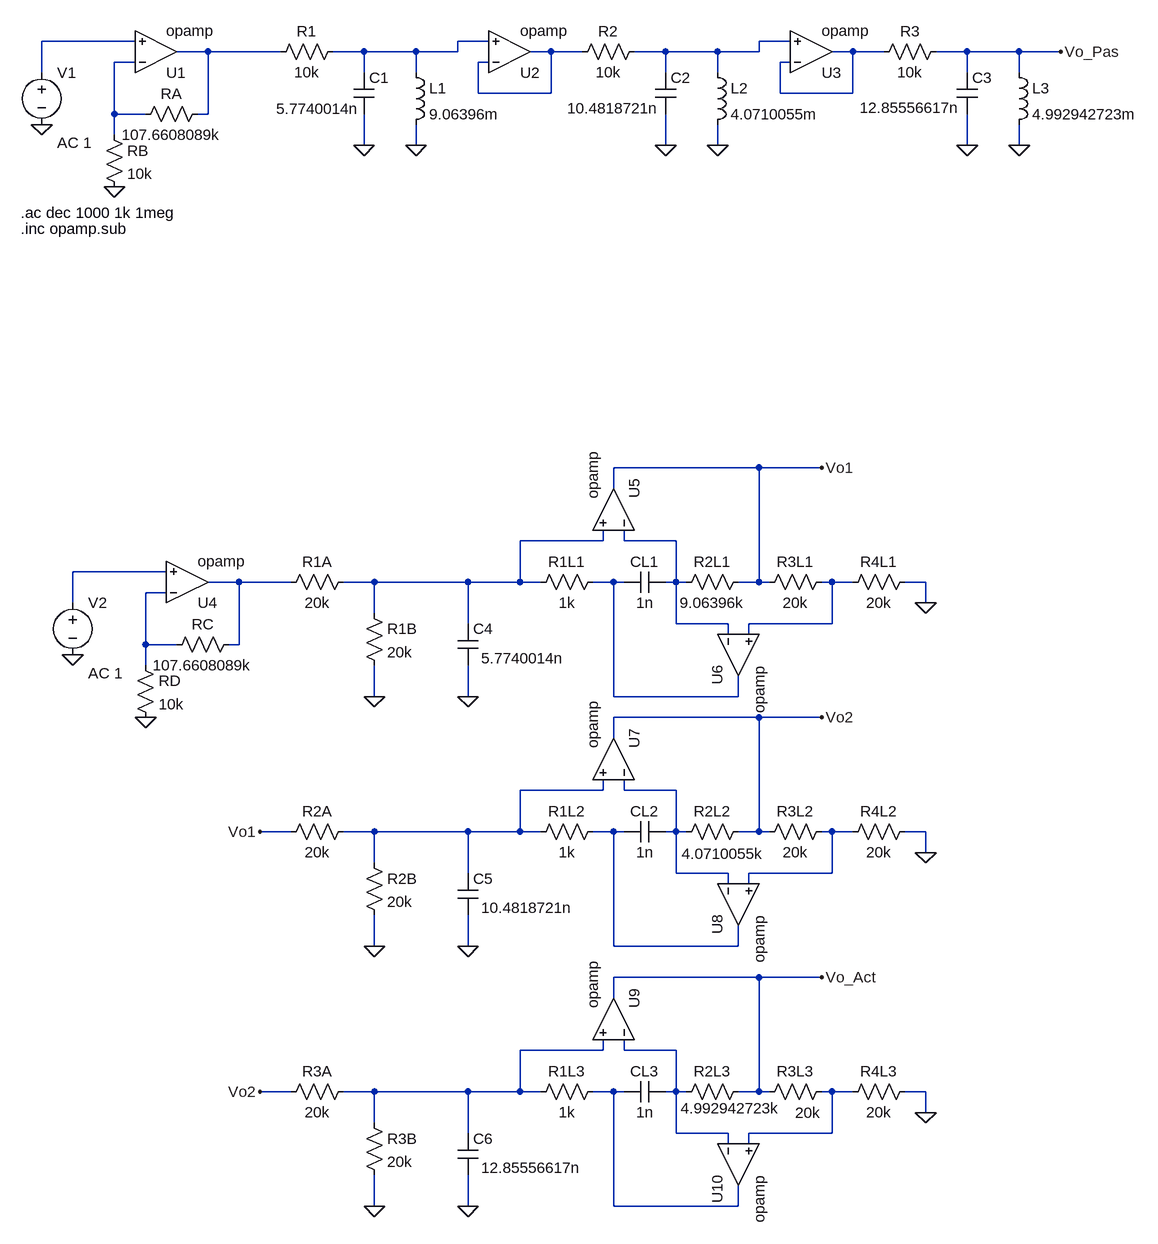
[diagram p0: schematic SeccionesPasivas.asc]
SeccionesPasivas.asc, the LTspice schematic file:
Version 4
SHEET 1 1620 1908
WIRE 0 96 -144 96
WIRE 544 96 496 96
WIRE 1008 96 960 96
WIRE 112 112 64 112
WIRE 224 112 112 112
WIRE 352 112 304 112
WIRE 432 112 352 112
WIRE 496 112 496 96
WIRE 496 112 432 112
WIRE 640 112 608 112
WIRE 688 112 640 112
WIRE 816 112 768 112
WIRE 896 112 816 112
WIRE 960 112 960 96
WIRE 960 112 896 112
WIRE 1104 112 1072 112
WIRE 1152 112 1104 112
WIRE 1280 112 1232 112
WIRE 1360 112 1280 112
WIRE 1424 112 1360 112
WIRE 0 128 -32 128
WIRE 544 128 528 128
WIRE 1008 128 992 128
WIRE -144 144 -144 96
WIRE 352 144 352 112
WIRE 432 144 432 112
WIRE 816 144 816 112
WIRE 896 144 896 112
WIRE 1280 144 1280 112
WIRE 1360 144 1360 112
WIRE 528 176 528 128
WIRE 640 176 640 112
WIRE 640 176 528 176
WIRE 992 176 992 128
WIRE 1104 176 1104 112
WIRE 1104 176 992 176
WIRE -32 208 -32 128
WIRE 16 208 -32 208
WIRE 112 208 112 112
WIRE 112 208 96 208
WIRE -32 240 -32 208
WIRE 352 256 352 208
WIRE 432 256 432 224
WIRE 816 256 816 208
WIRE 896 256 896 224
WIRE 1280 256 1280 208
WIRE 1360 256 1360 224
WIRE 960 752 736 752
WIRE 1056 752 960 752
WIRE 736 784 736 752
WIRE 720 864 720 848
WIRE 720 864 592 864
WIRE 752 864 752 848
WIRE 832 864 752 864
WIRE 48 912 -96 912
WIRE 160 928 112 928
WIRE 240 928 160 928
WIRE 368 928 320 928
WIRE 512 928 368 928
WIRE 592 928 592 864
WIRE 592 928 512 928
WIRE 624 928 592 928
WIRE 736 928 704 928
WIRE 752 928 736 928
WIRE 832 928 832 864
WIRE 832 928 816 928
WIRE 848 928 832 928
WIRE 960 928 960 752
WIRE 960 928 928 928
WIRE 976 928 960 928
WIRE 1072 928 1056 928
WIRE 1104 928 1072 928
WIRE 1216 928 1184 928
WIRE 48 944 16 944
WIRE -96 960 -96 912
WIRE 1216 960 1216 928
WIRE 368 976 368 928
WIRE 512 992 512 928
WIRE 832 992 832 928
WIRE 912 992 832 992
WIRE 1072 992 1072 928
WIRE 1072 992 944 992
WIRE 912 1008 912 992
WIRE 944 1008 944 992
WIRE 16 1024 16 944
WIRE 64 1024 16 1024
WIRE 160 1024 160 928
WIRE 160 1024 144 1024
WIRE 16 1056 16 1024
WIRE 368 1104 368 1056
WIRE 512 1104 512 1056
WIRE 736 1104 736 928
WIRE 928 1104 928 1072
WIRE 928 1104 736 1104
WIRE 960 1136 736 1136
WIRE 1056 1136 960 1136
WIRE 736 1168 736 1136
WIRE 720 1248 720 1232
WIRE 720 1248 592 1248
WIRE 752 1248 752 1232
WIRE 832 1248 752 1248
WIRE 240 1312 192 1312
WIRE 368 1312 320 1312
WIRE 512 1312 368 1312
WIRE 592 1312 592 1248
WIRE 592 1312 512 1312
WIRE 624 1312 592 1312
WIRE 736 1312 704 1312
WIRE 752 1312 736 1312
WIRE 832 1312 832 1248
WIRE 832 1312 816 1312
WIRE 848 1312 832 1312
WIRE 960 1312 960 1136
WIRE 960 1312 928 1312
WIRE 976 1312 960 1312
WIRE 1072 1312 1056 1312
WIRE 1104 1312 1072 1312
WIRE 1216 1312 1184 1312
WIRE 1216 1344 1216 1312
WIRE 368 1360 368 1312
WIRE 512 1376 512 1312
WIRE 832 1376 832 1312
WIRE 912 1376 832 1376
WIRE 1072 1376 1072 1312
WIRE 1072 1376 944 1376
WIRE 912 1392 912 1376
WIRE 944 1392 944 1376
WIRE 368 1488 368 1440
WIRE 512 1488 512 1440
WIRE 736 1488 736 1312
WIRE 928 1488 928 1456
WIRE 928 1488 736 1488
WIRE 960 1536 736 1536
WIRE 1056 1536 960 1536
WIRE 736 1568 736 1536
WIRE 720 1648 720 1632
WIRE 720 1648 592 1648
WIRE 752 1648 752 1632
WIRE 832 1648 752 1648
WIRE 240 1712 192 1712
WIRE 368 1712 320 1712
WIRE 512 1712 368 1712
WIRE 592 1712 592 1648
WIRE 592 1712 512 1712
WIRE 624 1712 592 1712
WIRE 736 1712 704 1712
WIRE 752 1712 736 1712
WIRE 832 1712 832 1648
WIRE 832 1712 816 1712
WIRE 848 1712 832 1712
WIRE 960 1712 960 1536
WIRE 960 1712 928 1712
WIRE 976 1712 960 1712
WIRE 1072 1712 1056 1712
WIRE 1104 1712 1072 1712
WIRE 1216 1712 1184 1712
WIRE 1216 1744 1216 1712
WIRE 368 1760 368 1712
WIRE 512 1776 512 1712
WIRE 832 1776 832 1712
WIRE 912 1776 832 1776
WIRE 1072 1776 1072 1712
WIRE 1072 1776 944 1776
WIRE 912 1792 912 1776
WIRE 944 1792 944 1776
WIRE 368 1888 368 1840
WIRE 512 1888 512 1840
WIRE 736 1888 736 1712
WIRE 928 1888 928 1856
WIRE 928 1888 736 1888
FLAG -32 320 0
FLAG 352 256 0
FLAG 432 256 0
FLAG 816 256 0
FLAG 896 256 0
FLAG 1280 256 0
FLAG 1360 256 0
FLAG 1424 112 Vo_Pas
FLAG -144 224 0
FLAG 16 1136 0
FLAG -96 1040 0
FLAG 368 1104 0
FLAG 512 1104 0
FLAG 1216 960 0
FLAG 1056 752 Vo1
FLAG 368 1488 0
FLAG 512 1488 0
FLAG 1216 1344 0
FLAG 1056 1136 Vo2
FLAG 368 1888 0
FLAG 512 1888 0
FLAG 1216 1744 0
FLAG 1056 1536 Vo_Act
FLAG 192 1312 Vo1
FLAG 192 1712 Vo2
SYMBOL OpAmps\\opamp 32 176 M180
SYMATTR InstName U1
SYMATTR SpiceLine Aol=100Meg
SYMATTR SpiceLine2 GBW=1000Meg
SYMBOL res -48 224 R0
SYMATTR InstName RB
SYMATTR Value 10k
SYMBOL res 112 192 R90
WINDOW 0 0 56 VBottom 2
WINDOW 3 32 56 VTop 2
SYMATTR InstName RA
SYMATTR Value 107.6608089k
SYMBOL res 320 96 R90
WINDOW 0 0 56 VBottom 2
WINDOW 3 32 56 VTop 2
SYMATTR InstName R1
SYMATTR Value 10k
SYMBOL cap 336 144 R0
WINDOW 3 -119 56 Left 2
SYMATTR Value 5.7740014n
SYMATTR InstName C1
SYMBOL ind 416 128 R0
SYMATTR InstName L1
SYMATTR Value 9.06396m
SYMBOL res 784 96 R90
WINDOW 0 0 56 VBottom 2
WINDOW 3 32 56 VTop 2
SYMATTR InstName R2
SYMATTR Value 10k
SYMBOL cap 800 144 R0
WINDOW 3 -135 55 Left 2
SYMATTR Value 10.4818721n
SYMATTR InstName C2
SYMBOL ind 880 128 R0
SYMATTR InstName L2
SYMATTR Value 4.0710055m
SYMBOL res 1248 96 R90
WINDOW 0 0 56 VBottom 2
WINDOW 3 32 56 VTop 2
SYMATTR InstName R3
SYMATTR Value 10k
SYMBOL cap 1264 144 R0
WINDOW 3 -149 54 Left 2
SYMATTR Value 12.85556617n
SYMATTR InstName C3
SYMBOL ind 1344 128 R0
SYMATTR InstName L3
SYMATTR Value 4.992942723m
SYMBOL voltage -144 128 R0
WINDOW 123 24 124 Left 2
WINDOW 39 0 0 Left 0
SYMATTR Value2 AC 1
SYMATTR InstName V1
SYMATTR Value ""
SYMBOL res 0 1040 R0
SYMATTR InstName RD
SYMATTR Value 10k
SYMBOL res 160 1008 R90
WINDOW 0 0 56 VBottom 2
WINDOW 3 32 56 VTop 2
SYMATTR InstName RC
SYMATTR Value 107.6608089k
SYMBOL voltage -96 944 R0
WINDOW 123 24 124 Left 2
WINDOW 39 0 0 Left 0
SYMATTR Value2 AC 1
SYMATTR InstName V2
SYMATTR Value ""
SYMBOL res 336 912 R90
WINDOW 0 0 56 VBottom 2
WINDOW 3 32 56 VTop 2
SYMATTR InstName R1A
SYMATTR Value 20k
SYMBOL res 352 960 R0
SYMATTR InstName R1B
SYMATTR Value 20k
SYMBOL cap 496 992 R0
WINDOW 3 36 53 Left 2
SYMATTR Value 5.7740014n
SYMATTR InstName C4
SYMBOL res 720 912 R90
WINDOW 0 0 56 VBottom 2
WINDOW 3 32 56 VTop 2
SYMATTR InstName R1L1
SYMATTR Value 1k
SYMBOL cap 816 912 R90
WINDOW 0 0 32 VBottom 2
WINDOW 3 32 32 VTop 2
SYMATTR InstName CL1
SYMATTR Value 1n
SYMBOL res 944 912 R90
WINDOW 0 0 56 VBottom 2
WINDOW 3 32 56 VTop 2
SYMATTR InstName R2L1
SYMATTR Value 9.06396k
SYMBOL res 1072 912 R90
WINDOW 0 0 56 VBottom 2
WINDOW 3 32 56 VTop 2
SYMATTR InstName R3L1
SYMATTR Value 20k
SYMBOL res 1200 912 R90
WINDOW 0 0 56 VBottom 2
WINDOW 3 32 56 VTop 2
SYMATTR InstName R4L1
SYMATTR Value 20k
SYMBOL res 336 1296 R90
WINDOW 0 0 56 VBottom 2
WINDOW 3 32 56 VTop 2
SYMATTR InstName R2A
SYMATTR Value 20k
SYMBOL res 352 1344 R0
SYMATTR InstName R2B
SYMATTR Value 20k
SYMBOL cap 496 1376 R0
WINDOW 3 36 53 Left 2
SYMATTR Value 10.4818721n
SYMATTR InstName C5
SYMBOL res 720 1296 R90
WINDOW 0 0 56 VBottom 2
WINDOW 3 32 56 VTop 2
SYMATTR InstName R1L2
SYMATTR Value 1k
SYMBOL cap 816 1296 R90
WINDOW 0 0 32 VBottom 2
WINDOW 3 32 32 VTop 2
SYMATTR InstName CL2
SYMATTR Value 1n
SYMBOL res 944 1296 R90
WINDOW 0 0 56 VBottom 2
WINDOW 3 34 40 VTop 2
SYMATTR InstName R2L2
SYMATTR Value 4.0710055k
SYMBOL res 1072 1296 R90
WINDOW 0 0 56 VBottom 2
WINDOW 3 32 56 VTop 2
SYMATTR InstName R3L2
SYMATTR Value 20k
SYMBOL res 1200 1296 R90
WINDOW 0 0 56 VBottom 2
WINDOW 3 32 56 VTop 2
SYMATTR InstName R4L2
SYMATTR Value 20k
SYMBOL res 336 1696 R90
WINDOW 0 0 56 VBottom 2
WINDOW 3 32 56 VTop 2
SYMATTR InstName R3A
SYMATTR Value 20k
SYMBOL res 352 1744 R0
SYMATTR InstName R3B
SYMATTR Value 20k
SYMBOL cap 496 1776 R0
WINDOW 3 36 53 Left 2
SYMATTR Value 12.85556617n
SYMATTR InstName C6
SYMBOL res 720 1696 R90
WINDOW 0 0 56 VBottom 2
WINDOW 3 32 56 VTop 2
SYMATTR InstName R1L3
SYMATTR Value 1k
SYMBOL cap 816 1696 R90
WINDOW 0 0 32 VBottom 2
WINDOW 3 32 32 VTop 2
SYMATTR InstName CL3
SYMATTR Value 1n
SYMBOL res 944 1696 R90
WINDOW 0 0 56 VBottom 2
WINDOW 3 26 28 VTop 2
SYMATTR InstName R2L3
SYMATTR Value 4.992942723k
SYMBOL res 1072 1696 R90
WINDOW 0 0 56 VBottom 2
WINDOW 3 33 37 VTop 2
SYMATTR InstName R3L3
SYMATTR Value 20k
SYMBOL res 1200 1696 R90
WINDOW 0 0 56 VBottom 2
WINDOW 3 32 56 VTop 2
SYMATTR InstName R4L3
SYMATTR Value 20k
SYMBOL OpAmps\\opamp 576 176 M180
SYMATTR InstName U2
SYMATTR SpiceLine Aol=100Meg
SYMATTR SpiceLine2 GBW=1000Meg
SYMBOL OpAmps\\opamp 1040 176 M180
SYMATTR InstName U3
SYMATTR SpiceLine Aol=100Meg
SYMATTR SpiceLine2 GBW=1000Meg
SYMBOL OpAmps\\opamp 80 992 M180
SYMATTR InstName U4
SYMATTR SpiceLine Aol=100Meg
SYMATTR SpiceLine2 GBW=1000Meg
SYMBOL OpAmps\\opamp 800 816 M270
SYMATTR InstName U5
SYMATTR SpiceLine Aol=100Meg
SYMATTR SpiceLine2 GBW=1000Meg
SYMBOL OpAmps\\opamp 864 1040 M90
SYMATTR InstName U6
SYMATTR SpiceLine Aol=100Meg
SYMATTR SpiceLine2 GBW=1000Meg
SYMBOL OpAmps\\opamp 800 1200 M270
SYMATTR InstName U7
SYMATTR SpiceLine Aol=100Meg
SYMATTR SpiceLine2 GBW=1000Meg
SYMBOL OpAmps\\opamp 864 1424 M90
SYMATTR InstName U8
SYMATTR SpiceLine Aol=100Meg
SYMATTR SpiceLine2 GBW=1000Meg
SYMBOL OpAmps\\opamp 800 1600 M270
SYMATTR InstName U9
SYMATTR SpiceLine Aol=100Meg
SYMATTR SpiceLine2 GBW=1000Meg
SYMBOL OpAmps\\opamp 864 1824 M90
SYMATTR InstName U10
SYMATTR SpiceLine Aol=100Meg
SYMATTR SpiceLine2 GBW=1000Meg
TEXT -176 360 Left 2 !.ac dec 1000 1k 1meg
TEXT -176 384 Left 2 !.inc opamp.sub

The netlist it stands for:
* SeccionesPasivas.asc
XU1 N007 N001 N004 opamp Aol=100Meg GBW=1000Meg  ; pins invin noninvin out
RB N007 0 10k
RA N004 N007 107.6608089k
R1 N002 N004 10k
C1 N002 0 5.7740014n
L1 N002 0 9.06396m
R2 N003 N005 10k
C2 N003 0 10.4818721n
L2 N003 0 4.0710055m
R3 Vo_Pas N006 10k
C3 Vo_Pas 0 12.85556617n
L3 Vo_Pas 0 4.992942723m
V1 N001 0 AC 1
RD N014 0 10k
RC N011 N014 107.6608089k
V2 N010 0 AC 1
R1A N008 N011 20k
R1B N008 0 20k
C4 N008 0 5.7740014n
R1L1 N012 N008 1k
CL1 N009 N012 1n
R2L1 Vo1 N009 9.06396k
R3L1 N013 Vo1 20k
R4L1 0 N013 20k
R2A N015 Vo1 20k
R2B N015 0 20k
C5 N015 0 10.4818721n
R1L2 N017 N015 1k
CL2 N016 N017 1n
R2L2 Vo2 N016 4.0710055k
R3L2 N018 Vo2 20k
R4L2 0 N018 20k
R3A N019 Vo2 20k
R3B N019 0 20k
C6 N019 0 12.85556617n
R1L3 N021 N019 1k
CL3 N020 N021 1n
R2L3 Vo_Act N020 4.992942723k
R3L3 N022 Vo_Act 20k
R4L3 0 N022 20k
XU2 N005 N002 N005 opamp Aol=100Meg GBW=1000Meg  ; pins invin noninvin out
XU3 N006 N003 N006 opamp Aol=100Meg GBW=1000Meg  ; pins invin noninvin out
XU4 N014 N010 N011 opamp Aol=100Meg GBW=1000Meg  ; pins invin noninvin out
XU5 N009 N008 Vo1 opamp Aol=100Meg GBW=1000Meg  ; pins invin noninvin out
XU6 N009 N013 N012 opamp Aol=100Meg GBW=1000Meg  ; pins invin noninvin out
XU7 N016 N015 Vo2 opamp Aol=100Meg GBW=1000Meg  ; pins invin noninvin out
XU8 N016 N018 N017 opamp Aol=100Meg GBW=1000Meg  ; pins invin noninvin out
XU9 N020 N019 Vo_Act opamp Aol=100Meg GBW=1000Meg  ; pins invin noninvin out
XU10 N020 N022 N021 opamp Aol=100Meg GBW=1000Meg  ; pins invin noninvin out
.ac dec 1000 1k 1meg
.inc opamp.sub
.backanno
.end

* Results of the author's LTspice run, read from the files saved beside the schematic
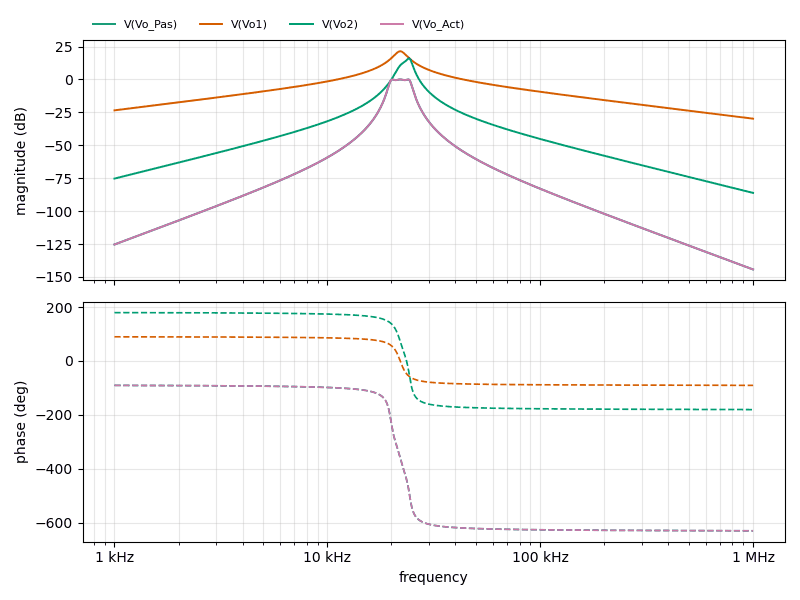
[diagram p1: AC Analysis of SeccionesPasivas.asc, plotted from the saved traces]
* AC Analysis, 1 run:
*   V(Vo_Pas): -125.33 dB at 1 kHz, -144.29 dB at 1 MHz, peak -0.00 dB at 23.99 kHz, 3 dB below the peak at 19.58 kHz and 24.72 kHz
*   V(Vo1): -23.46 dB at 1 kHz, -29.78 dB at 1 MHz, peak 21.41 dB at 21.98 kHz, 3 dB below the peak at 20.66 kHz and 23.42 kHz
*   V(Vo2): -75.29 dB at 1 kHz, -86.15 dB at 1 MHz, peak 16.00 dB at 24.15 kHz, 3 dB below the peak at 22.91 kHz and 24.87 kHz
*   V(Vo_Act): -125.33 dB at 1 kHz, -144.29 dB at 1 MHz, peak 0.00 dB at 23.99 kHz, 3 dB below the peak at 19.58 kHz and 24.72 kHz